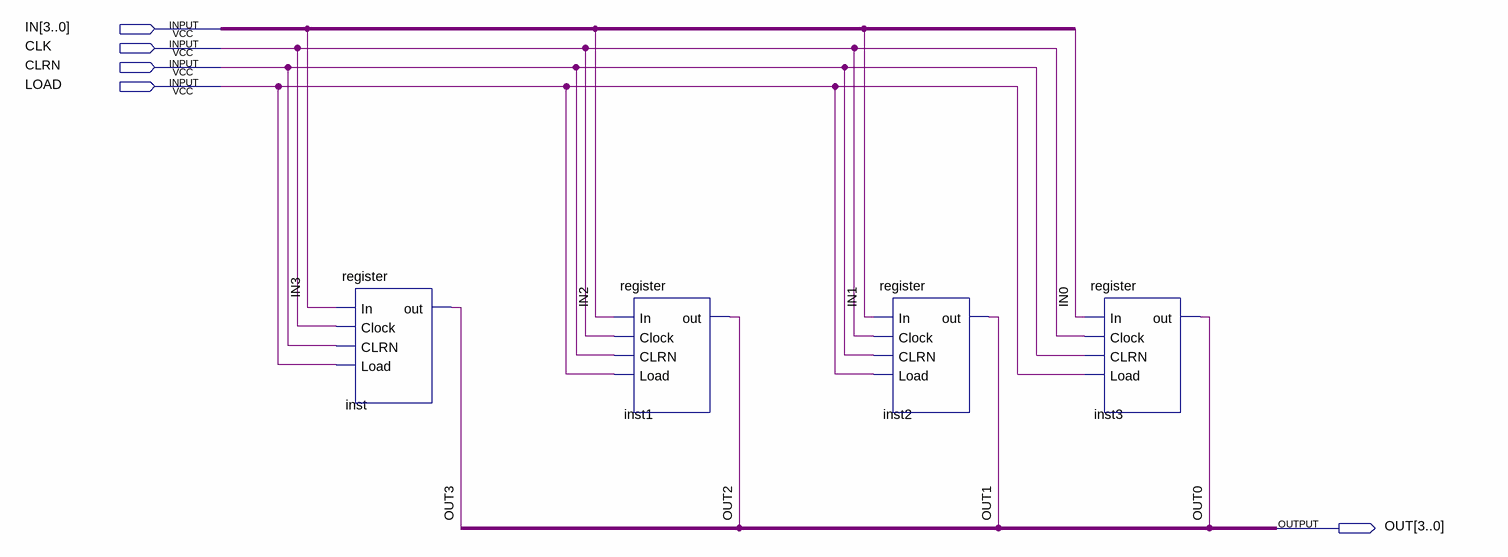
[diagram p0: schematic sheet]
// Quartus schematic reg4b.bdf as structural Verilog: 4 symbols, 5 pins
module reg4b (
  input  [3:0] IN,
  input  CLK,
  input  CLRN,
  input  LOAD,
  output [3:0] OUT
);

  register inst (.In(IN[3]), .Clock(CLK), .CLRN(CLRN), .Load(LOAD), .out(OUT[3]));
  register inst1 (.In(IN[2]), .Clock(CLK), .CLRN(CLRN), .Load(LOAD), .out(OUT[2]));
  register inst2 (.In(IN[1]), .Clock(CLK), .CLRN(CLRN), .Load(LOAD), .out(OUT[1]));
  register inst3 (.In(IN[0]), .Clock(CLK), .CLRN(CLRN), .Load(LOAD), .out(OUT[0]));
endmodule
